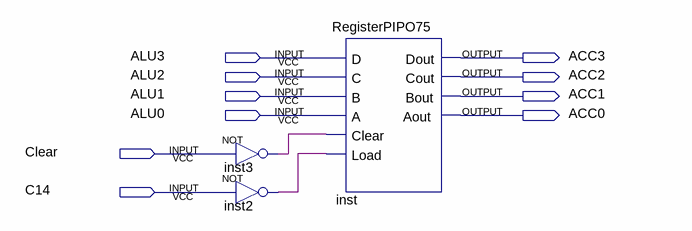
[diagram p0: schematic sheet]
// Quartus schematic BR.bdf as structural Verilog: 3 symbols, 10 pins
module BR (
  input  ALU3,
  input  ALU2,
  input  ALU1,
  input  ALU0,
  input  Clear,
  input  C14,
  output ACC3,
  output ACC2,
  output ACC1,
  output ACC0
);

  wire inst2_out, inst3_out;

  not inst3 (inst3_out, Clear);
  not inst2 (inst2_out, C14);
  RegisterPIPO75 inst (
    .D(ALU3), .C(ALU2), .B(ALU1), .A(ALU0), .Clear(inst3_out), .Load(inst2_out), .Dout(ACC3), .Cout(ACC2),
    .Bout(ACC1), .Aout(ACC0));
endmodule
